# Altium schematic sheet MayBanNuocTuDong.SchDoc
size A
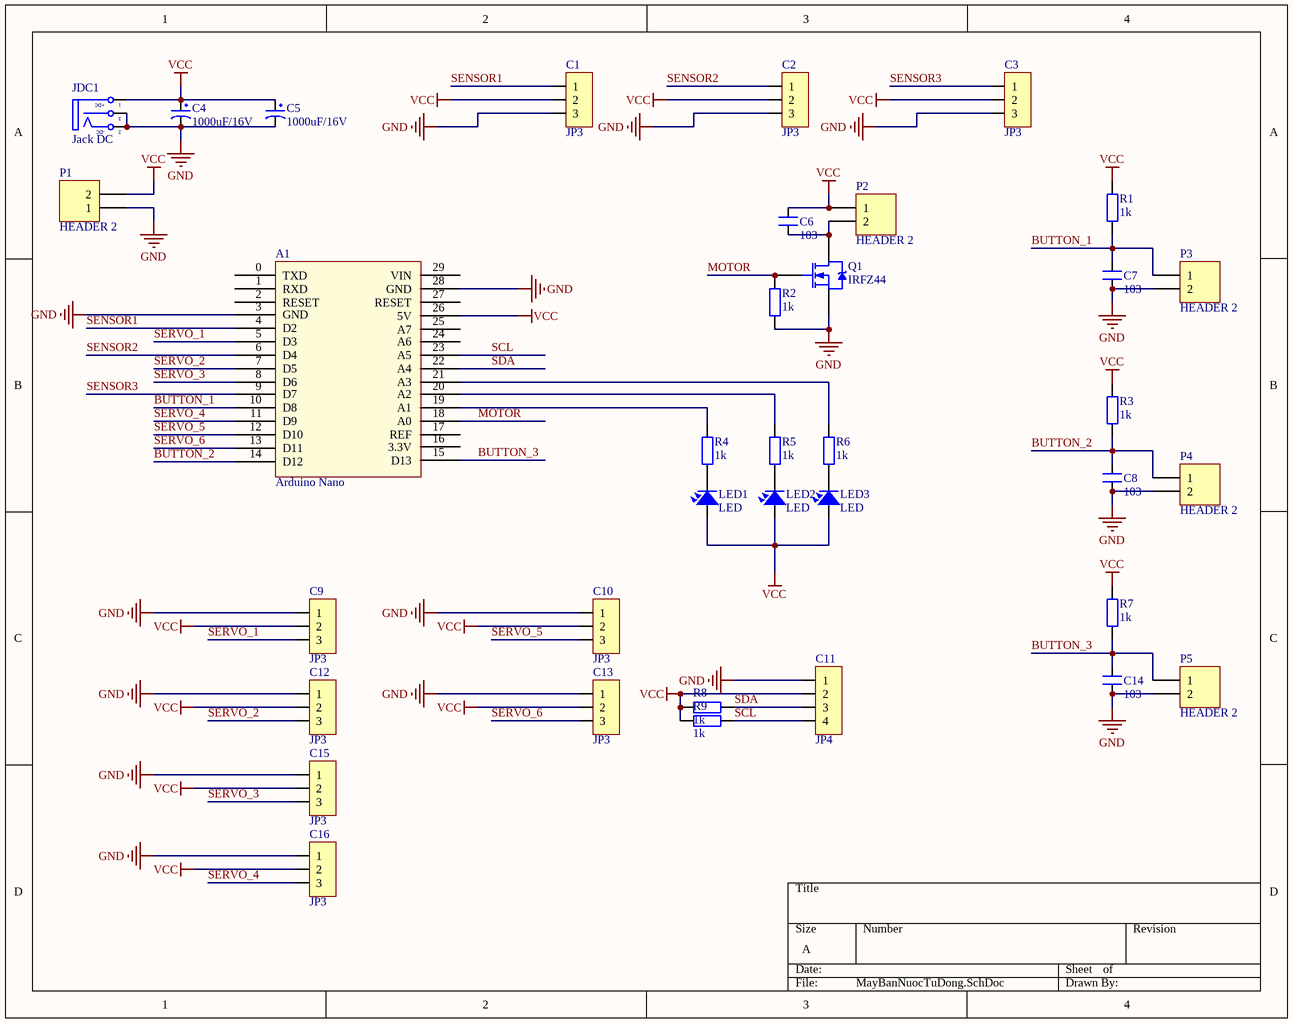
[diagram p0: MayBanNuocTuDong.SchDoc]

## Parts
A1  Arduino Nano  [Arduino Nano]
C1  JP3  [JP3-D1T]
C2  JP3  [JP3-D1T]
C3  JP3  [JP3-D1T]
C4  1000uF/16V  [CP1.5/3.4]
C5  1000uF/16V  [CP1.5/3.4]
C6  103  [SM-0805]
C7  103  [SM-0805]
C8  103  [SM-0805]
C9  JP3  [JP3-D1T]
C10  JP3  [JP3-D1T]
C11  JP4  [JP4-C1T]
C12  JP3  [JP3-D1T]
C13  JP3  [JP3-D1T]
C14  103  [SM-0805]
C15  JP3  [JP3-D1T]
C16  JP3  [JP3-D1T]
JDC1  Jack DC  [DC0]
LED1  LED  [LED-5-BLUE]
LED2  LED  [LED-5-BLUE]
LED3  LED  [LED-5-BLUE]
P1  HEADER 2  [CON 2]
P2  HEADER 2  [CON 2]
P3  HEADER 2  [CON 2]
P4  HEADER 2  [CON 2]
P5  HEADER 2  [CON 2]
Q1  IRFZ44  [TO252-123]
R1  1k  [RES-SMD-0805]
R2  1k  [RES-SMD-0805]
R3  1k  [RES-SMD-0805]
R4  1k  [RES-SMD-0805]
R5  1k  [RES-SMD-0805]
R6  1k  [RES-SMD-0805]
R7  1k  [RES-SMD-0805]
R8  1k  [RES-SMD-0805]
R9  1k  [RES-SMD-0805]

## Nets
GND: A1.3(GND) A1.28(GND) C1.3 C2.3 C3.3 C4.2 C5.2 C7.1 C8.1 C9.1 C10.1 C11.1 C12.1 C13.1 C14.1 C15.1 C16.1 JDC1.2(TN) JDC1.3(S) P1.1 P3.2 P4.2 P5.2 Q1.3(S) R2.1
VCC: A1.26(5V) C1.2 C2.2 C3.2 C4.1 C5.1 C6.2 C9.2 C10.2 C11.2 C12.2 C13.2 C15.2 C16.2 JDC1.1(T) LED1.1 LED2.1 LED3.1 P1.2 P2.1 R1.2 R3.2 R7.2 R8.2 R9.2
BUTTON_1: A1.10(D8) C7.2 P3.1 R1.1
BUTTON_2: A1.14(D12) C8.2 P4.1 R3.1
BUTTON_3: A1.15(D13) C14.2 P5.1 R7.1
MOTOR: A1.18(A0) Q1.1(G) R2.2
SCL: A1.23(A5) C11.4 R9.1
SDA: A1.22(A4) C11.3 R8.1
SENSOR1: A1.4(D2) C1.1
SENSOR2: A1.6(D4) C2.1
SENSOR3: A1.9(D7) C3.1
SERVO_1: A1.5(D3) C9.3
SERVO_2: A1.7(D5) C12.3
SERVO_3: A1.8(D6) C15.3
SERVO_4: A1.11(D9) C16.3
SERVO_5: A1.12(D10) C10.3
SERVO_6: A1.13(D11) C13.3
NetA1_19: A1.19(A1) R4.2
NetA1_20: A1.20(A2) R5.2
NetA1_21: A1.21(A3) R6.2
NetC6_1: C6.1 P2.2 Q1.2(D)
NetLED1_2: LED1.2 R4.1
NetLED2_2: LED2.2 R5.1
NetLED3_2: LED3.2 R6.1

Not connected (* = marked no-connect by the designer): A1 0(TXD) 1(RXD) 2(RESET) 16(3.3V) 17(REF) 24(A6) 25(A7) 27(RESET) 29(VIN)

## Notes on the sheet
- (in symbol JACK_DC) +DC; -DC

## Library data of the parts
C1-C3 C9 C10 C12 C13 C15 C16 = JP3: WR-PHD 2.54 mm Angled Socket Header; Manufacturer: W¨¹rth Elektronik eiSos GmbH; partNo: 613003143121; ComponentLink1 Description: Manufacturer; ComponentLink2 Description: Datasheet; NoPins: 03; Created Date: 29 March 2013; ComponentLink1URL: http://www.we-online.com; ComponentLink2URL: http://katalog.we-online.de/em/datasheet/6130xx143121.pdf; Created by: Karrer Zheng
C4 C5 = CP4: Cap 1000uF/16V - 220uF/50V; Description 5: 4,7uF>10uF/250V_3,3uF>10uF/400V - 2,2uF>4,7uF/450V; Description 1: 2200uF-3300uF/6,3V - 1000uF-2200uF/10V; Description 2: 1000uF/16V - 470uF => 1000uF/25V - 100uF/100V; Description 3: 330uF>470uF/35V_220uF>470uF/50V_10uF>22uF/250V; Description 4: 220uF => 330uF/63V - 10uF =>33uF/160 - 200V; Value: 1000uF/16V
C6-C8 C14 = CM: Cap SMD; Value: 103
C11 = JP4: WR-PHD 2.54 mm Angled Socket Header; Manufacturer: W¨¹rth Elektronik eiSos GmbH; partNo: 613004143121; ComponentLink1 Description: Manufacturer; ComponentLink2 Description: Datasheet; NoPins: 04; Created Date: 29 March 2013; ComponentLink1URL: http://www.we-online.com; ComponentLink2URL: http://katalog.we-online.de/em/datasheet/6130xx143121.pdf; Created by: Karrer Zheng
JDC1 = JACK_DC
Q1 = IRFZ44: Value: IRF840
R1-R9 = R: Resistor R1/4W